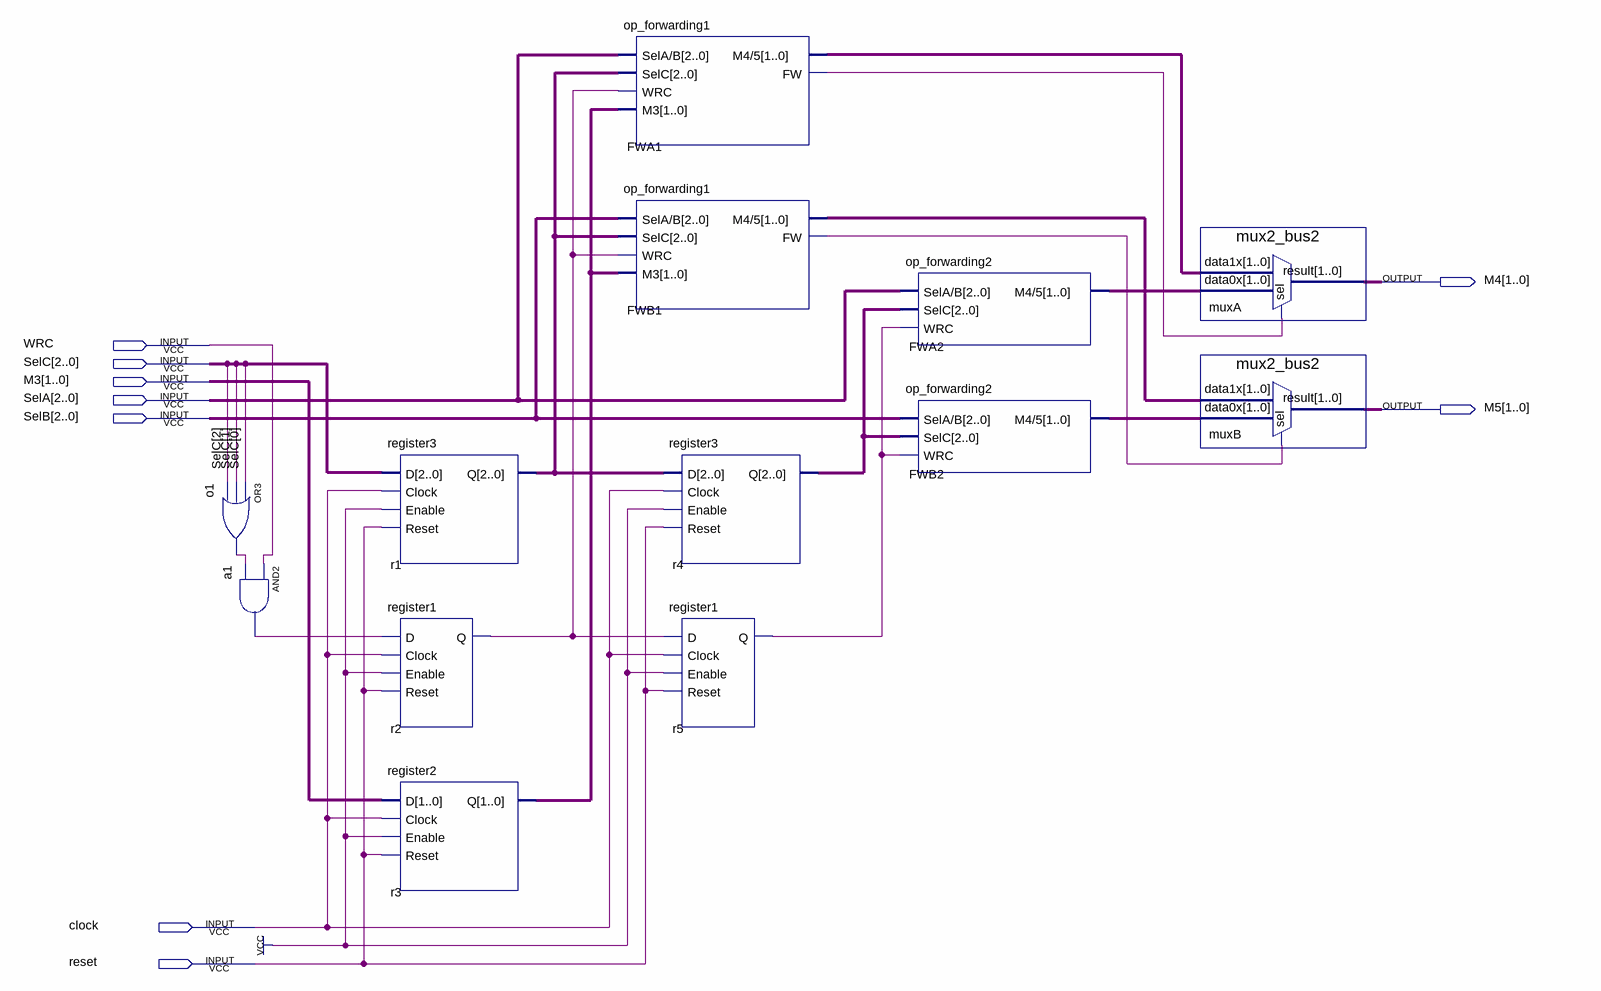
[diagram p0: schematic sheet]
// Quartus schematic data_forwarding.bdf as structural Verilog: 13 symbols, 9 pins
module data_forwarding (
  input  WRC,
  input  [2:0] SelC,
  input  [1:0] M3,
  input  [2:0] SelA,
  input  [2:0] SelB,
  input  clock,
  input  reset,
  output [1:0] M4,
  output [1:0] M5
);

  wire a1_out, FWA1_fw, FWB1_fw, o1_out, r2_q, r5_q;
  wire [1:0] FWA1_m4_5, FWA2_m4_5, FWB1_m4_5, FWB2_m4_5, r3_q;
  wire [2:0] r1_q, r4_q;

  or o1 (o1_out, SelC[0], SelC[1], SelC[2]);
  and a1 (a1_out, WRC, o1_out);
  register3 r1 (.D(SelC), .Clock(clock), .Enable(1'b1), .Reset(reset), .Q(r1_q));
  register1 r2 (.D(a1_out), .Clock(clock), .Enable(1'b1), .Reset(reset), .Q(r2_q));
  register2 r3 (.D(M3), .Clock(clock), .Enable(1'b1), .Reset(reset), .Q(r3_q));
  op_forwarding1 FWA1 (.\SelA/B (SelA), .SelC(r1_q), .WRC(r2_q), .M3(r3_q), .\M4/5 (FWA1_m4_5), .FW(FWA1_fw));
  op_forwarding1 FWB1 (.\SelA/B (SelB), .SelC(r1_q), .WRC(r2_q), .M3(r3_q), .\M4/5 (FWB1_m4_5), .FW(FWB1_fw));
  register3 r4 (.D(r1_q), .Clock(clock), .Enable(1'b1), .Reset(reset), .Q(r4_q));
  register1 r5 (.D(r2_q), .Clock(clock), .Enable(1'b1), .Reset(reset), .Q(r5_q));
  op_forwarding2 FWA2 (.\SelA/B (SelA), .SelC(r4_q), .WRC(r5_q), .\M4/5 (FWA2_m4_5));
  op_forwarding2 FWB2 (.\SelA/B (SelB), .SelC(r4_q), .WRC(r5_q), .\M4/5 (FWB2_m4_5));
  mux2_bus2 muxA (.data1x(FWA1_m4_5), .data0x(FWA2_m4_5), .sel(FWA1_fw), .result(M4));
  mux2_bus2 muxB (.data1x(FWB1_m4_5), .data0x(FWB2_m4_5), .sel(FWB1_fw), .result(M5));
endmodule
